# Altium schematic sheet taplam.SchDoc
size A
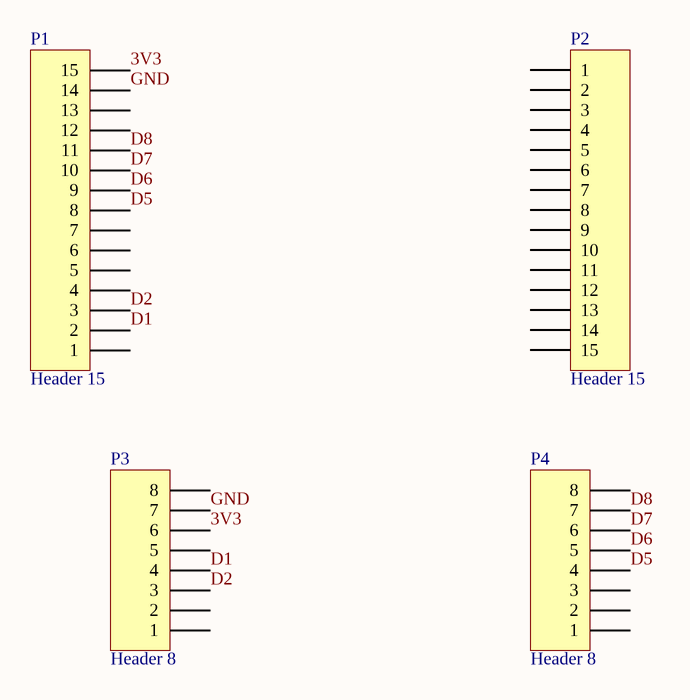
[diagram p0: taplam.SchDoc]

## Parts
P1  Header 15  [HDR1X15]
P2  Header 15  [HDR1X15]
P3  Header 8  [HDR1X8]
P4  Header 8  [HDR1X8]

## Nets
3V3: P1.15 P3.6
D1: P1.2 P3.4
D2: P1.3 P3.3
D5: P1.8 P4.4
D6: P1.9 P4.5
D7: P1.10 P4.6
D8: P1.11 P4.7
GND: P1.14 P3.7

Not connected (* = marked no-connect by the designer): P1 1 4 5 6 7 12 13; P2 1 2 3 4 5 6 7 8 9 10 11 12 13 14 15; P3 1 2 5 8; P4 1 2 3 8

## Library data of the parts
P1 P2 = Header 15: Header, 15-Pin; LatestRevisionDate: 17-Jul-2002; LatestRevisionNote: Re-released for DXP Platform.; Publisher: Altium Limited
P3 P4 = Header 8: Header, 8-Pin; LatestRevisionDate: 17-Jul-2002; LatestRevisionNote: Re-released for DXP Platform.; Publisher: Altium Limited